# EAGLE design rpicam (EAGLE 7.6.0)
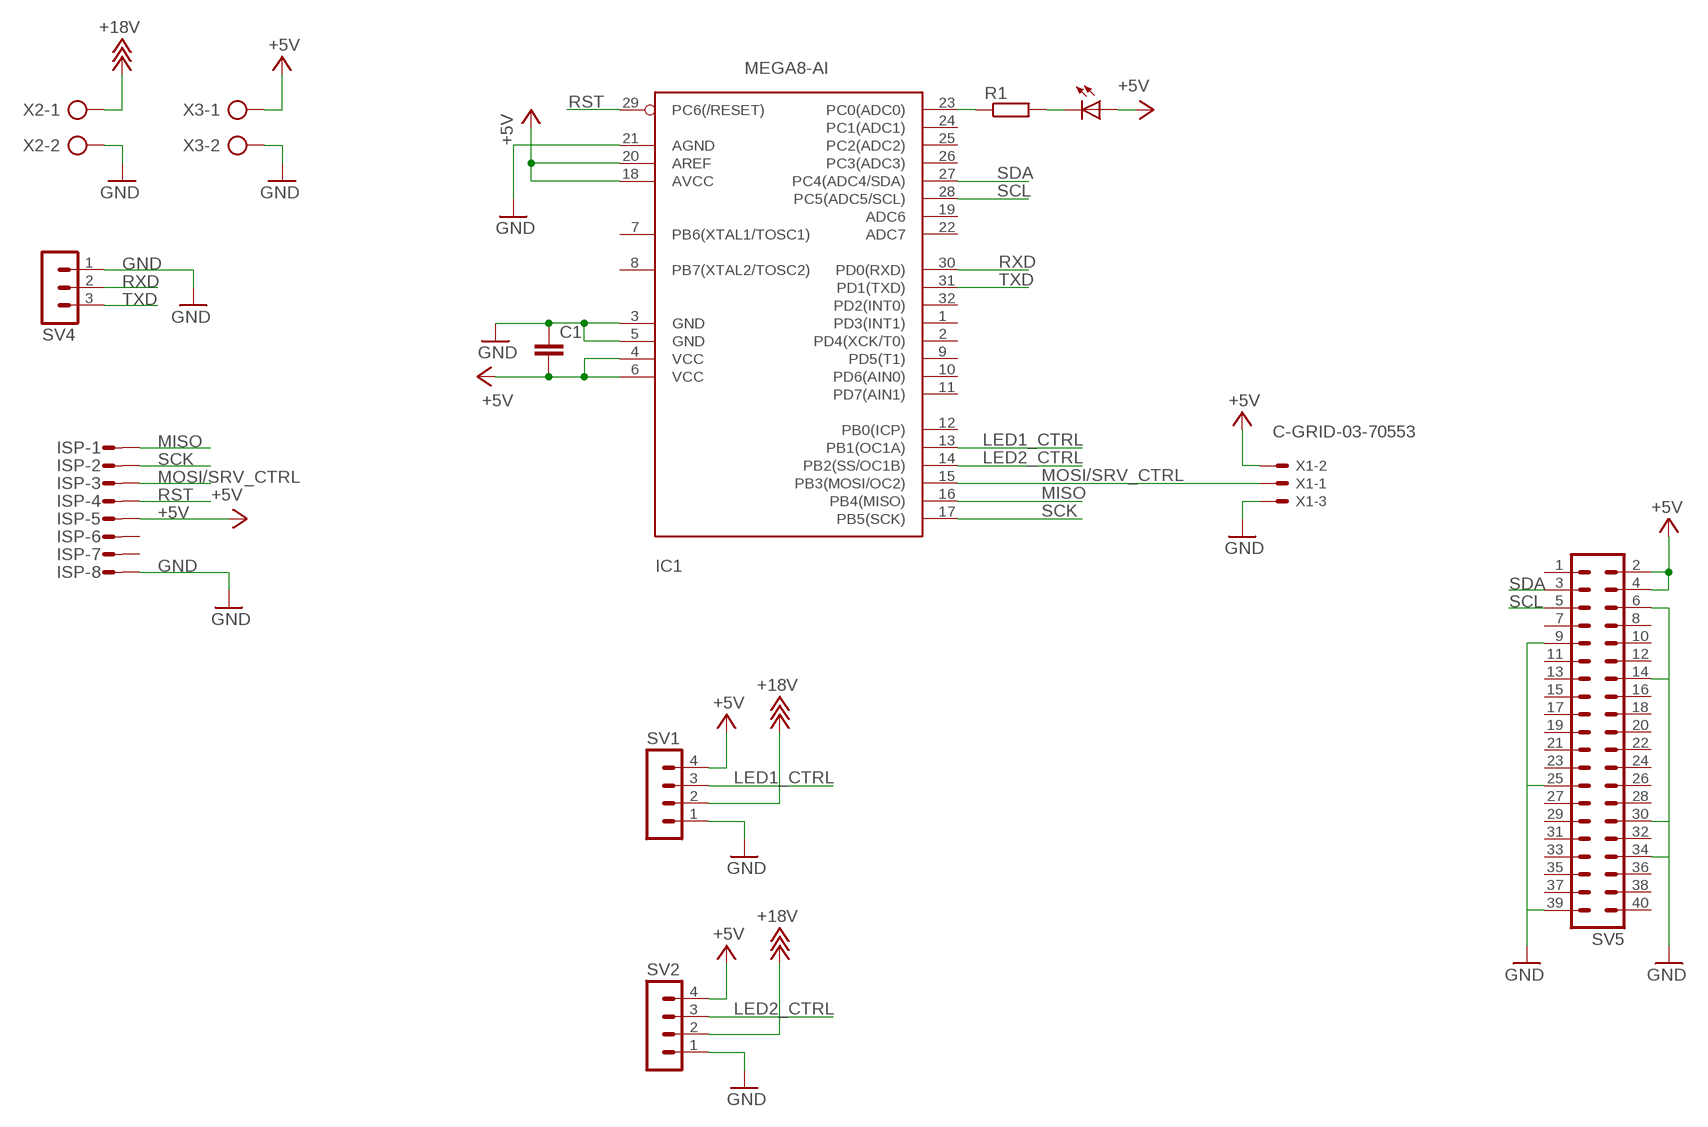
[diagram p0: schematic, sheet 1]

## Parts
C1  C-EUC0805  [C0805]
IC1  MEGA8-AI  [TQFP32-08]
ISP  MICROMATCH-8  [MICROMATCH-8]
LED1  LEDCHIP-LED0805  [CHIP-LED0805]
R1  R-EU_R0805  [R0805]
SV1  MA04-1  [MA04-1]
SV2  MA04-1  [MA04-1]
SV4  MA03-1  [MA03-1]
SV5  MA20-2  [MA20-2]
X1  C-GRID-03-70553  [70553-03]
X2  AK500/2  [AK500/2]
X3  AK500/2  [AK500/2]

## Nets
+5V: C1.2 IC1.4(VCC) IC1.6(VCC) IC1.18(AVCC) IC1.20(AREF) ISP.5 LED1.A SV1.4 SV2.4 SV5.2 SV5.4 X1.2 X3.1
+18V: SV1.2 SV2.2 X2.1
GND: C1.1 IC1.3(GND) IC1.5(GND) IC1.21(AGND) ISP.8 SV1.1 SV2.1 SV4.1 SV5.6 SV5.9 SV5.14 SV5.25 SV5.30 SV5.34 SV5.39 X1.3 X2.2 X3.2
LED1_CTRL: IC1.13(PB1(OC1A)) SV1.3
LED2_CTRL: IC1.14(PB2(SS/OC1B)) SV2.3
MISO: IC1.16(PB4(MISO)) ISP.1
MOSI/SRV_CTRL: IC1.15(PB3(MOSI/OC2)) ISP.3 X1.1
N$1: LED1.C R1.2
N$4: IC1.23(PC0(ADC0)) R1.1
RST: IC1.29(PC6(/RESET)) ISP.4
RXD: IC1.30(PD0(RXD)) SV4.2
SCK: IC1.17(PB5(SCK)) ISP.2
SCL: IC1.28(PC5(ADC5/SCL)) SV5.5
SDA: IC1.27(PC4(ADC4/SDA)) SV5.3
TXD: IC1.31(PD1(TXD)) SV4.3
Unconnected: IC1.1(PD3(INT1)) IC1.2(PD4(XCK/T0)) IC1.7(PB6(XTAL1/TOSC1)) IC1.8(PB7(XTAL2/TOSC2)) IC1.9(PD5(T1)) IC1.10(PD6(AIN0)) IC1.11(PD7(AIN1)) IC1.12(PB0(ICP)) IC1.19(ADC6) IC1.22(ADC7) IC1.24(PC1(ADC1)) IC1.25(PC2(ADC2)) IC1.26(PC3(ADC3)) IC1.32(PD2(INT0)) ISP.6 ISP.7 SV5.1 SV5.7 SV5.8 SV5.10 SV5.11 SV5.12 SV5.13 SV5.15 SV5.16 SV5.17 SV5.18 SV5.19 SV5.20 SV5.21 SV5.22 SV5.23 SV5.24 SV5.26 SV5.27 SV5.28 SV5.29 SV5.31 SV5.32 SV5.33 SV5.35 SV5.36 SV5.37 SV5.38 SV5.40

## Library data of the parts
C1 = rcl:C-EU: CAPACITOR, European symbol
IC1 = atmel:MEGA8: MICROCONTROLLER 8 Kbytes FLASH, 1 kbytes SRAM, 512 bytes EEPROM, USART, 6-channel 10 bit ADC, 2-channel 8 bit ADC Pin compatible with Atmega48, ATMega88, ATMega168 Source: avr.lbr
ISP = con-amp-micromatch:MICROMATCH-8: MicroMaTch 8 7-215464-8 / 0-215464-8 Drawing Number C-215464 DDEController.pdf; MF: FARNELL; MPN: 7-215464-8; OC_FARNELL: 3784642; OC_NEWARK: 26H0301
LED1 = led:LED: LED OSRAM: - CHIPLED LG R971, LG N971, LY N971, LG Q971, LY Q971, LO R971, LY R971 LH N974, LH R974 LS Q976, LO Q976, LY Q976 LO Q996 - Hyper CHIPLED LW Q18S LB Q993, LB Q99A, LB R99A - SideLED LS A670, LO A670, LY A670, LG A670, LP A670 LB A673, LV A673, LT A673, LW A673 LH A674 LY A675 LS A676, LA A676, LO A676, LY A676, LW A676 LS A679, LY A679, LG A679 - Hyper Micro SIDELED® LS Y876, LA Y876, LO Y876, LY Y876 LT Y87S - SmartLED LW L88C, LW L88S LB L89C, LB L89S, LG L890 LS L89K, LO L89K, LY L89K LS L896, LA L896, LO L896, LY L896 - TOPLED LS T670, LO T670, LY T670, LG T670, LP T670 LSG T670, LSP T670, LSY T670, LOP T670, LYG T670 LG T671, LOG T671, LSG T671 LB T673, LV T673, LT T673, LW T673 LH T674 LS T676, LA T676, LO T676, LY T676, LB T676, LH T676, LSB T676, LW T676 LB T67C, LV T67C, LT T67C, LS T67K, LO T67K, LY T67K, LW E67C LS E67B, LA E67B, LO E67B, LY E67B, LB E67C, LV E67C, LT E67C LW T67C LS T679, LY T679, LG T679 LS T770, LO T770, LY T770, LG T770, LP T770 LB T773, LV T773, LT T773, LW T773 LH T774 LS E675, LA E675, LY E675, LS T675 LS T776, LA T776, LO T776, LY T776, LB T776 LHGB T686 LT T68C, LB T68C - Hyper Mini TOPLED® LB M676 - Mini TOPLED Santana® LG M470 LS M47K, LO M47K, LY M47K Source: http://www.osram.convergy.de LUXEON: - LUMILED® LXK2-PW12-R00, LXK2-PW12-S00, LXK2-PW14-U00, LXK2-PW14-V00 LXK2-PM12-R00, LXK2-PM12-S00, LXK2-PM14-U00 LXK2-PE12-Q00, LXK2-PE12-R00, LXK2-PE12-S00, LXK2-PE14-T00, LXK2-PE14-U00 LXK2-PB12-K00, LXK2-PB12-L00, LXK2-PB12-M00, LXK2-PB14-N00, LXK2-PB14-P00, LXK2-PB14-Q00 LXK2-PR12-L00, LXK2-PR12-M00, LXK2-PR14-Q00, LXK2-PR14-R00 LXK2-PD12-Q00, LXK2-PD12-R00, LXK2-PD12-S00 LXK2-PH12-R00, LXK2-PH12-S00 LXK2-PL12-P00, LXK2-PL12-Q00, LXK2-PL12-R00 Source: www.luxeon.com KINGBRIGHT: KA-3528ASYC Source: www.kingbright.com
R1 = rcl:R-EU_: RESISTOR, European symbol
SV1 SV2 = con-lstb:MA04-1: PIN HEADER; OC_FARNELL: unknown; OC_NEWARK: unknown
SV4 = con-lstb:MA03-1: PIN HEADER; OC_FARNELL: unknown; OC_NEWARK: unknown
SV5 = con-lstb:MA20-2: PIN HEADER; OC_FARNELL: unknown; OC_NEWARK: unknown
X1 = con-molex:C-GRID-03: CONNECTOR wire to board 2.54 mm (0.100") pitch header; OC_FARNELL: unknown; OC_NEWARK: unknown
X2 X3 = con-ptr500:AK500/2: CONNECTOR; OC_FARNELL: unknown; OC_NEWARK: unknown

## Board
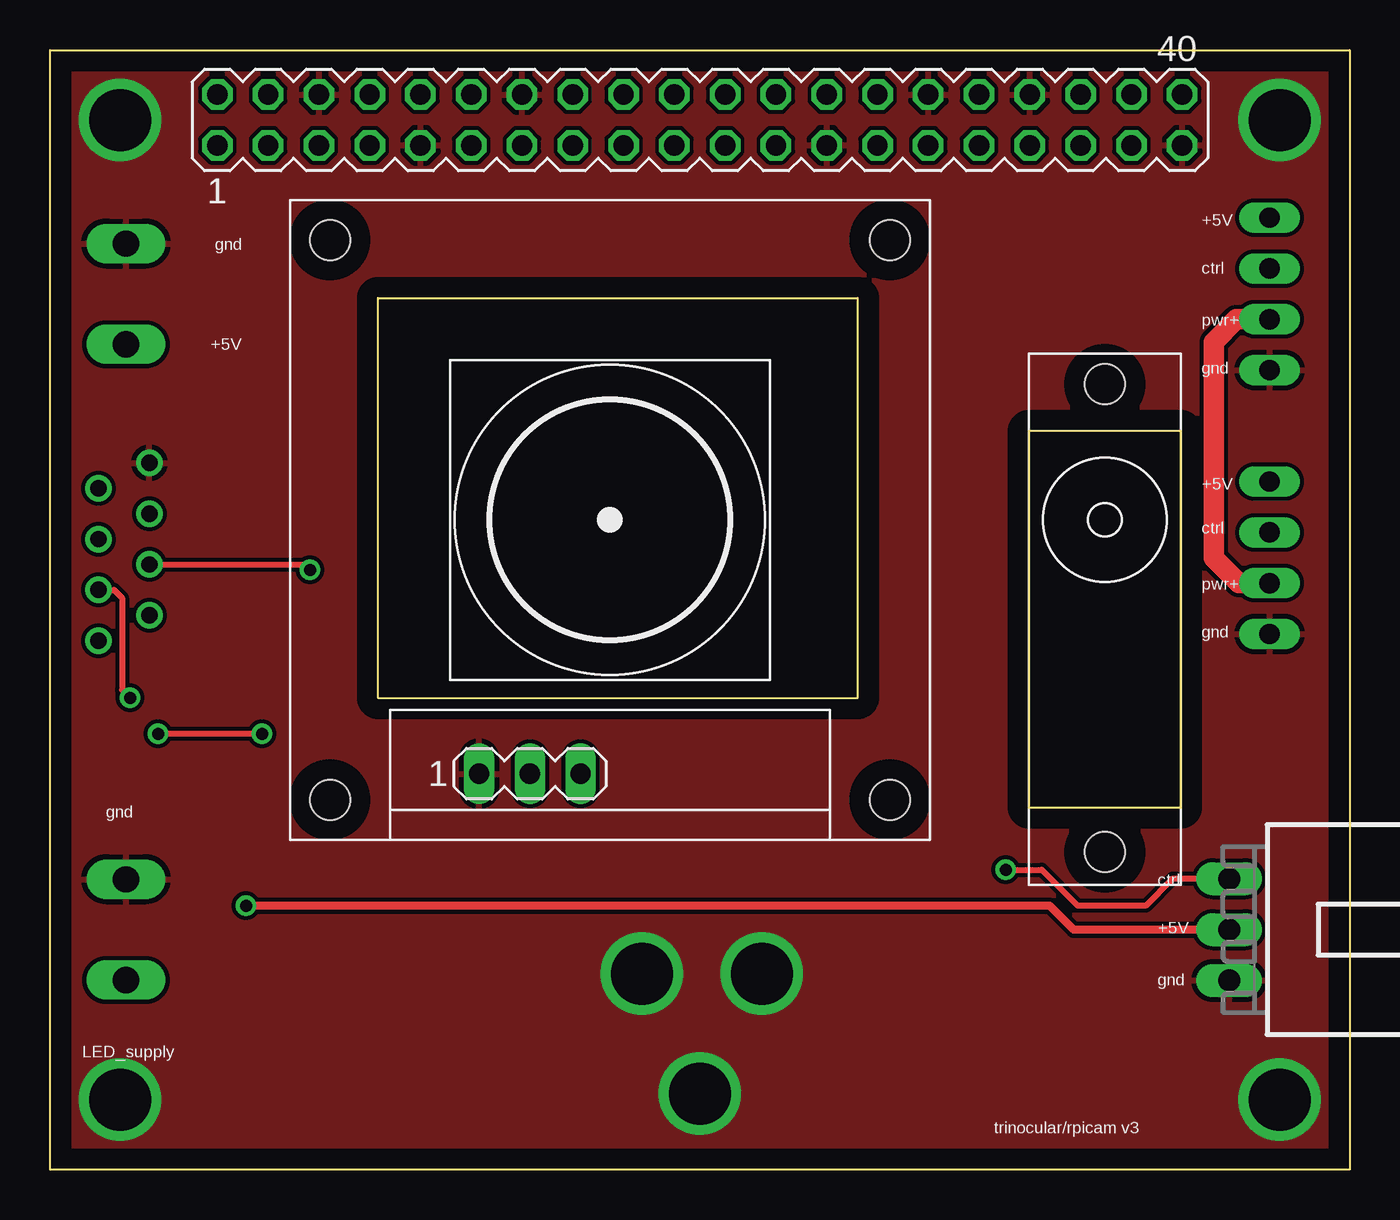
[diagram p1: board, top side]
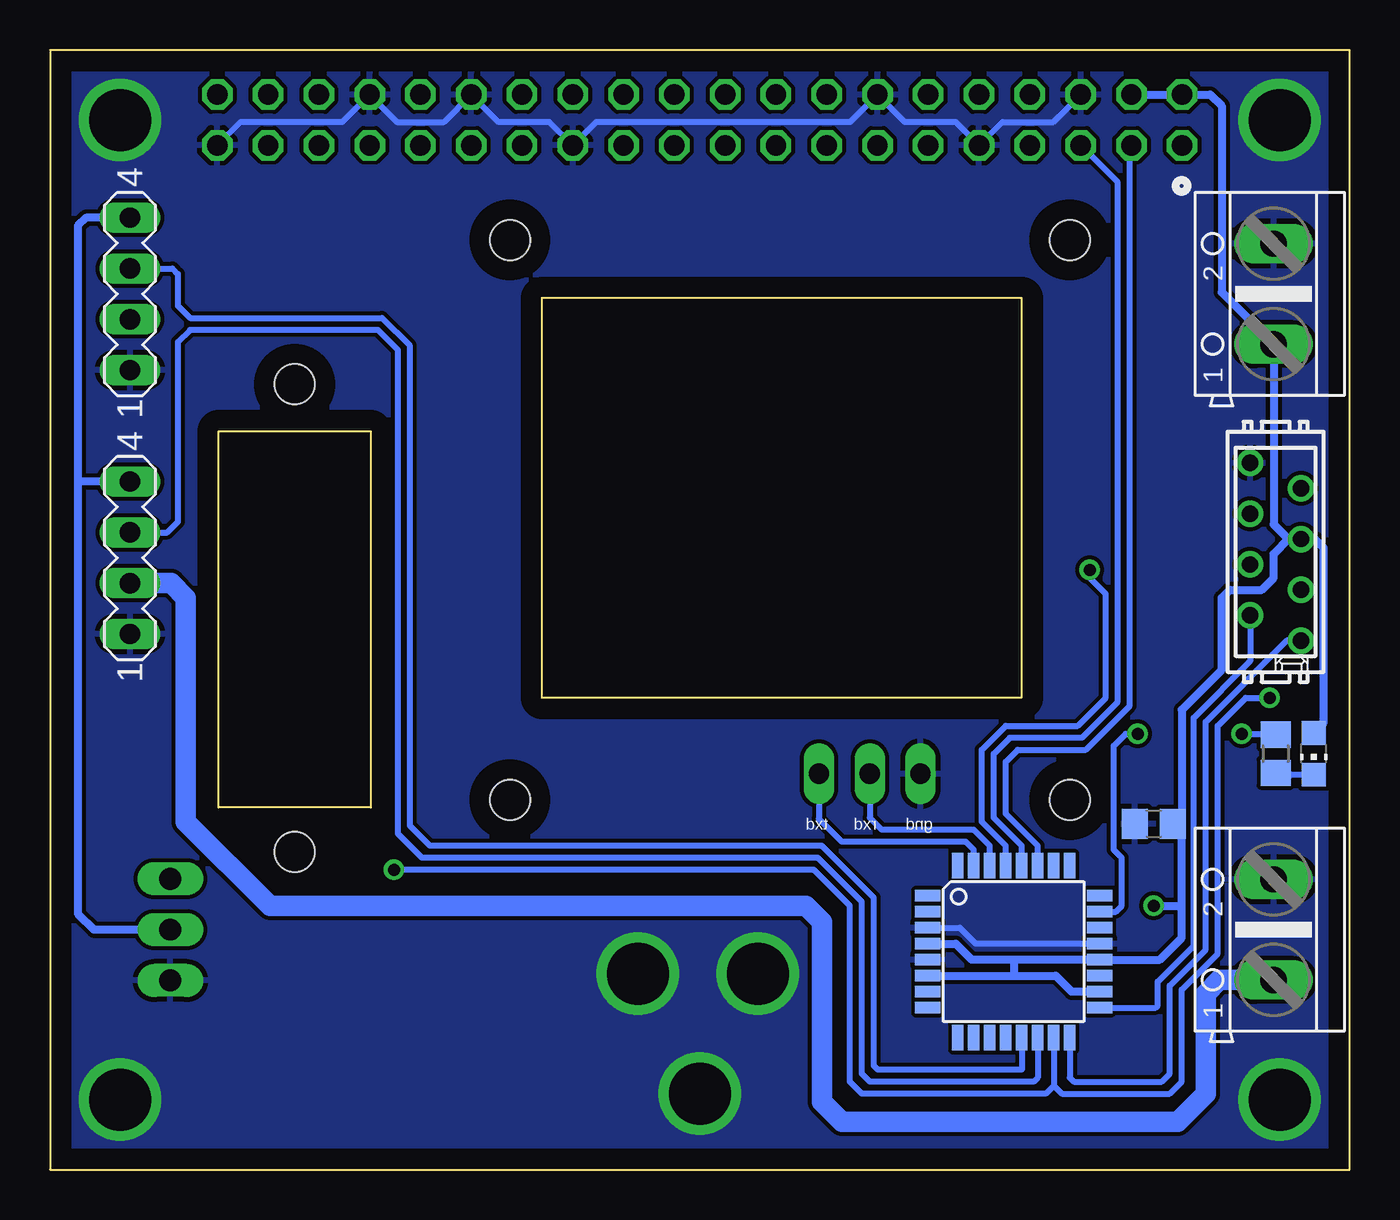
[diagram p2: board, bottom side, seen from below]

Size 65 x 56 mm. Coordinates in mm from the lower left corner, seen from the top.
Outline: 0,56 65,56 65,0 0,0 0,56
Outline: 16.4,23.6 16.4,43.6 40.4,43.6 40.4,23.6 16.4,23.6
Copper layers (1*16): Top 0.035mm / dielectric 1.5mm / Bottom 0.035mm
Design rules "default": minimum track width 10mil, minimum drill 24mil, track to track 8mil, track to pad 8mil, pad to pad 8mil, via to via 8mil, smd to smd 8mil, copper to edge 40mil, drill to drill 8mil, minimum pad ring 10mil, minimum via ring 8mil, stop-mask expansion 4mil, vias tented up to drill 0mil, thermal gap 10mil

### Footprints (pad centres in the part's own frame; a part is rotated, then mirrored left to right if it is on the bottom)
C0805 = smd 1.3 x 1.5: 1 -0.95,0; 2 0.95,0
TQFP32-08 = smd 1.27 x 0.559: 1 -4.293,2.8; 2 -4.293,2; 3 -4.293,1.2; 4 -4.293,0.4; 5 -4.293,-0.4; 6 -4.293,-1.2; 7 -4.293,-2; 8 -4.293,-2.8; 17 4.293,-2.8; 18 4.293,-2; 19 4.293,-1.2; 20 4.293,-0.4; 21 4.293,0.4; 22 4.293,1.2; 23 4.293,2; 24 4.293,2.8 | smd 0.559 x 1.27: 9 -2.8,-4.293; 10 -2,-4.293; 11 -1.2,-4.293; 12 -0.4,-4.293; 13 0.4,-4.293; 14 1.2,-4.293; 15 2,-4.293; 16 2.8,-4.293; 25 2.8,4.293; 26 2,4.293; 27 1.2,4.293; 28 0.4,4.293; 29 -0.4,4.293; 30 -1.2,4.293; 31 -2,4.293; 32 -2.8,4.293
MICROMATCH-8 = drill 0.813: 1 4.445,1.27; 2 3.175,-1.27; 3 1.905,1.27; 4 0.635,-1.27; 5 -0.635,1.27; 6 -1.905,-1.27; 7 -3.175,1.27; 8 -4.445,-1.27
CHIP-LED0805 = smd 1.2 x 1.2: A 0,-1.05; C 0,1.05
R0805 = smd 1.3 x 1.5: 1 -0.95,0; 2 0.95,0
MA04-1 = drill 1.016 long: 1 -3.81,0; 2 -1.27,0; 3 1.27,0; 4 3.81,0
MA03-1 = drill 1.016 long: 1 -2.54,0; 2 0,0; 3 2.54,0
MA20-2 = drill 1.016 octagon: 1 -24.13,-1.27; 2 -24.13,1.27; 3 -21.59,-1.27; 4 -21.59,1.27; 5 -19.05,-1.27; 6 -19.05,1.27; 7 -16.51,-1.27; 8 -16.51,1.27; 9 -13.97,-1.27; 10 -13.97,1.27; 11 -11.43,-1.27; 12 -11.43,1.27; 13 -8.89,-1.27; 14 -8.89,1.27; 15 -6.35,-1.27; 16 -6.35,1.27; 17 -3.81,-1.27; 18 -3.81,1.27; 19 -1.27,-1.27; 20 -1.27,1.27; 21 1.27,-1.27; 22 1.27,1.27; 23 3.81,-1.27; 24 3.81,1.27; 25 6.35,-1.27; 26 6.35,1.27; 27 8.89,-1.27; 28 8.89,1.27; 29 11.43,-1.27; 30 11.43,1.27; 31 13.97,-1.27; 32 13.97,1.27; 33 16.51,-1.27; 34 16.51,1.27; 35 19.05,-1.27; 36 19.05,1.27; 37 21.59,-1.27; 38 21.59,1.27; 39 24.13,-1.27; 40 24.13,1.27
HS-35HD = hole 2: 0,-16.62; 0,6.78
RPICAM_WAVESHARE = hole 2: -14,-14; 14,-14; -14,14; 14,14
70553-03 = drill 1.092 long: 1 -2.54,-7.62; 2 0,-7.62; 3 2.54,-7.62
AK500/2 = drill 1.321 long: 1 -2.515,0; 2 2.515,0

### Placement (x,y rotation side)
C1  9.8,17.3 0 bottom
IC1  16.8,10.9 0 bottom
ISP  3.7,30.9 270 bottom
LED1  1.8,20.8 180 bottom
R1  3.7,20.8 270 bottom
SV1  61,43.8 90 bottom
SV2  61,30.6 90 bottom
SV4  24,19.8 0 top
SV5  32.5,52.5 0 top
U$3  [HS-35HD]  52.76,32.5 0 top
U$4  [RPICAM_WAVESHARE]  28,32.5 0 top
X1  66.6,12 270 top
X2  3.8,12 90 bottom
X3  3.8,43.8 90 bottom

### Tracks (layer width: path | path; a pad name or v marks a point on that pad's centre or on a via)
+5V  (via drill 0.6)
  Top 0.406: X1.2 51.2,12 50,13.2 v9.8,13.2
  Bottom 0.305: 8.4,17.75 C1.2 8.4,16.85 | 63.59,34.41 63.6,34.4
  Bottom 0.406: 16.8,10.5 IC1.20 9.5,10.5 8.4,11.6 8.4,13.2 | 16.8,10.5 18.9,10.5 19.7,11.3 IC1.4 | IC1.6 16.8,9.7 | 16.8,9.7 14.7,9.7 13.9,8.9 IC1.18 | 16.8,10.5 16.8,9.7 | 8.4,13.2 8.4,16.85 | 8.4,17.75 8.4,23 6.4,25 6.4,28.6 6,29 4.4,29 3.8,29.6 3.8,30.8 3.06,31.54 | SV5.4 SV5.2 6.97,53.77 6.4,53.2 6.4,43.88 X3.1 3.8,32.27 3.06,31.54 | v9.8,13.2 8.4,13.2 | 3.06,31.54 ISP.5 1.74,31.54 1.3,31.1 1.3,22.35 LED1.A | SV2.4 63.59,34.41 | X1.2 62.8,12 63.6,12.8 63.6,34.4 63.6,47.2 63.19,47.61 SV1.4
+18V
  Top 1.016: SV2.2 59.47,29.33 58.2,30.6 58.2,41.4 59.33,42.53 SV1.2
  Bottom 1.016: X2.1 6.51,9.48 7.2,8.8 7.2,3.8 8.6,2.4 25.4,2.4 26.4,3.4 26.4,12.4 27.2,13.2 54,13.2 58.2,17.4 58.2,28.6 58.93,29.33 SV2.2
GND  (via drill 3.1)
  Bottom 0.305: SV5.6 14.82,52.4 17.36,52.4 SV5.9 19.7,52.4 22.24,52.4 SV5.14 24.98,52.4 37.68,52.4 SV5.25 40.02,52.4 42.56,52.4 SV5.30 45.3,52.4 47.64,52.4 SV5.34 50.38,52.4 55.46,52.4 SV5.39 | IC1.21 18.7,11.3 19.5,12.1 IC1.3
  other vias: 61.5,3.5 3.5,52.5 3.5,3.5 61.5,52.5 29.6,9.8 35.6,9.8 32.5,3.8
  pour Bottom: 0,56 65,56 65,0 0,0
  pour Top: 0,56 65,56 65,0 0,0
LED1_CTRL
  Bottom 0.305: IC1.13 16.4,5 23.6,5 23.8,5.2 23.8,13.6 26.4,16.2 46,16.2 47,17.2 47,41.2 48.4,42.6 58,42.6 58.6,43.2 58.6,44.8 58.87,45.07 SV1.3
LED2_CTRL
  Bottom 0.305: IC1.14 15.6,4.6 15.8,4.4 24,4.4 24.4,4.8 24.4,13.4 26.6,15.6 46.4,15.6 47.6,16.8 47.6,41 48.6,42 58,42 58.6,41.4 58.6,32.4 59.13,31.87 SV2.3
MISO
  Bottom 0.305: IC1.16 14,4.6 13.8,4.4 9.4,4.4 9,4.8 9,9.2 7.2,11 7.2,22.4 3.15,26.45 ISP.1
MOSI/SRV_CTRL  (via drill 0.6)
  Top 0.305: v47.8,15 49.6,15 51.4,13.2 54.8,13.2 56.14,14.54 X1.1 | ISP.3 3.21,29 3.6,28.6 3.6,24 v4,23.6
  Bottom 0.305: 14.8,4.2 15.2,3.8 24.4,3.8 25,4.4 25,13.2 26.8,15 v47.8,15 | IC1.15 14.8,4.2 | 14.8,4.2 14.4,3.8 9,3.8 8.4,4.4 8.4,9 6.6,10.8 6.6,22.2 5.2,23.6 v4,23.6
N$1
  Bottom 0.305: LED1.C 3.4,19.75
  Bottom 1.016: R1.2 3.5,19.85 3.4,19.75
N$4  (via drill 0.6)
  Top 0.305: v10.6,21.8 v5.4,21.8
  Bottom 0.305: v10.6,21.8 11.2,21.8 11.8,21.2 11.8,16 11.4,15.6 11.4,13.2 11.7,12.9 IC1.23 | v5.4,21.8 3.6,21.8 3.55,21.8
  Bottom 1.016: R1.1 3.65,21.75 3.6,21.8
RST  (via drill 0.6)
  Top 0.305: ISP.4 12.73,30.27 v13,30
  Bottom 0.305: IC1.29 17.2,16.2 18.4,17.4 18.4,21 17.2,22.2 13.6,22.2 12.2,23.6 12.2,28.8 13,29.6 v13,30
RXD
  Bottom 0.305: IC1.30 18,16.2 18.8,17 23.4,17 24,17.6 SV4.2
SCK
  Bottom 0.305: ISP.2 4.97,25.43 7.8,22.6 7.8,11.2 9.6,9.4 9.6,8.2 9.7,8.1 IC1.17
SCL
  Bottom 0.305: IC1.28 16.4,16.2 17.8,17.6 17.8,20.8 17,21.6 13.4,21.6 11.6,23.4 11.6,49.38 SV5.5
SDA
  Bottom 0.305: IC1.27 15.6,16.2 17.2,17.8 17.2,20.4 16.6,21 13.2,21 11,23.2 11,51.14 SV5.3
TXD
  Bottom 0.305: IC1.31 18.8,16 19.2,16.4 25.4,16.4 26.54,17.54 SV4.3

### Text on the board
tNames: gnd | +5V | ctrl | +5V | pwr+ | gnd | +5V | ctrl | pwr+ | gnd | gnd | ctrl | +5V | gnd | LED_supply | trinocular/rpicam v3
bNames: gnd | rxd | txd